# EAGLE design recepteur_led (EAGLE 6.5.0)
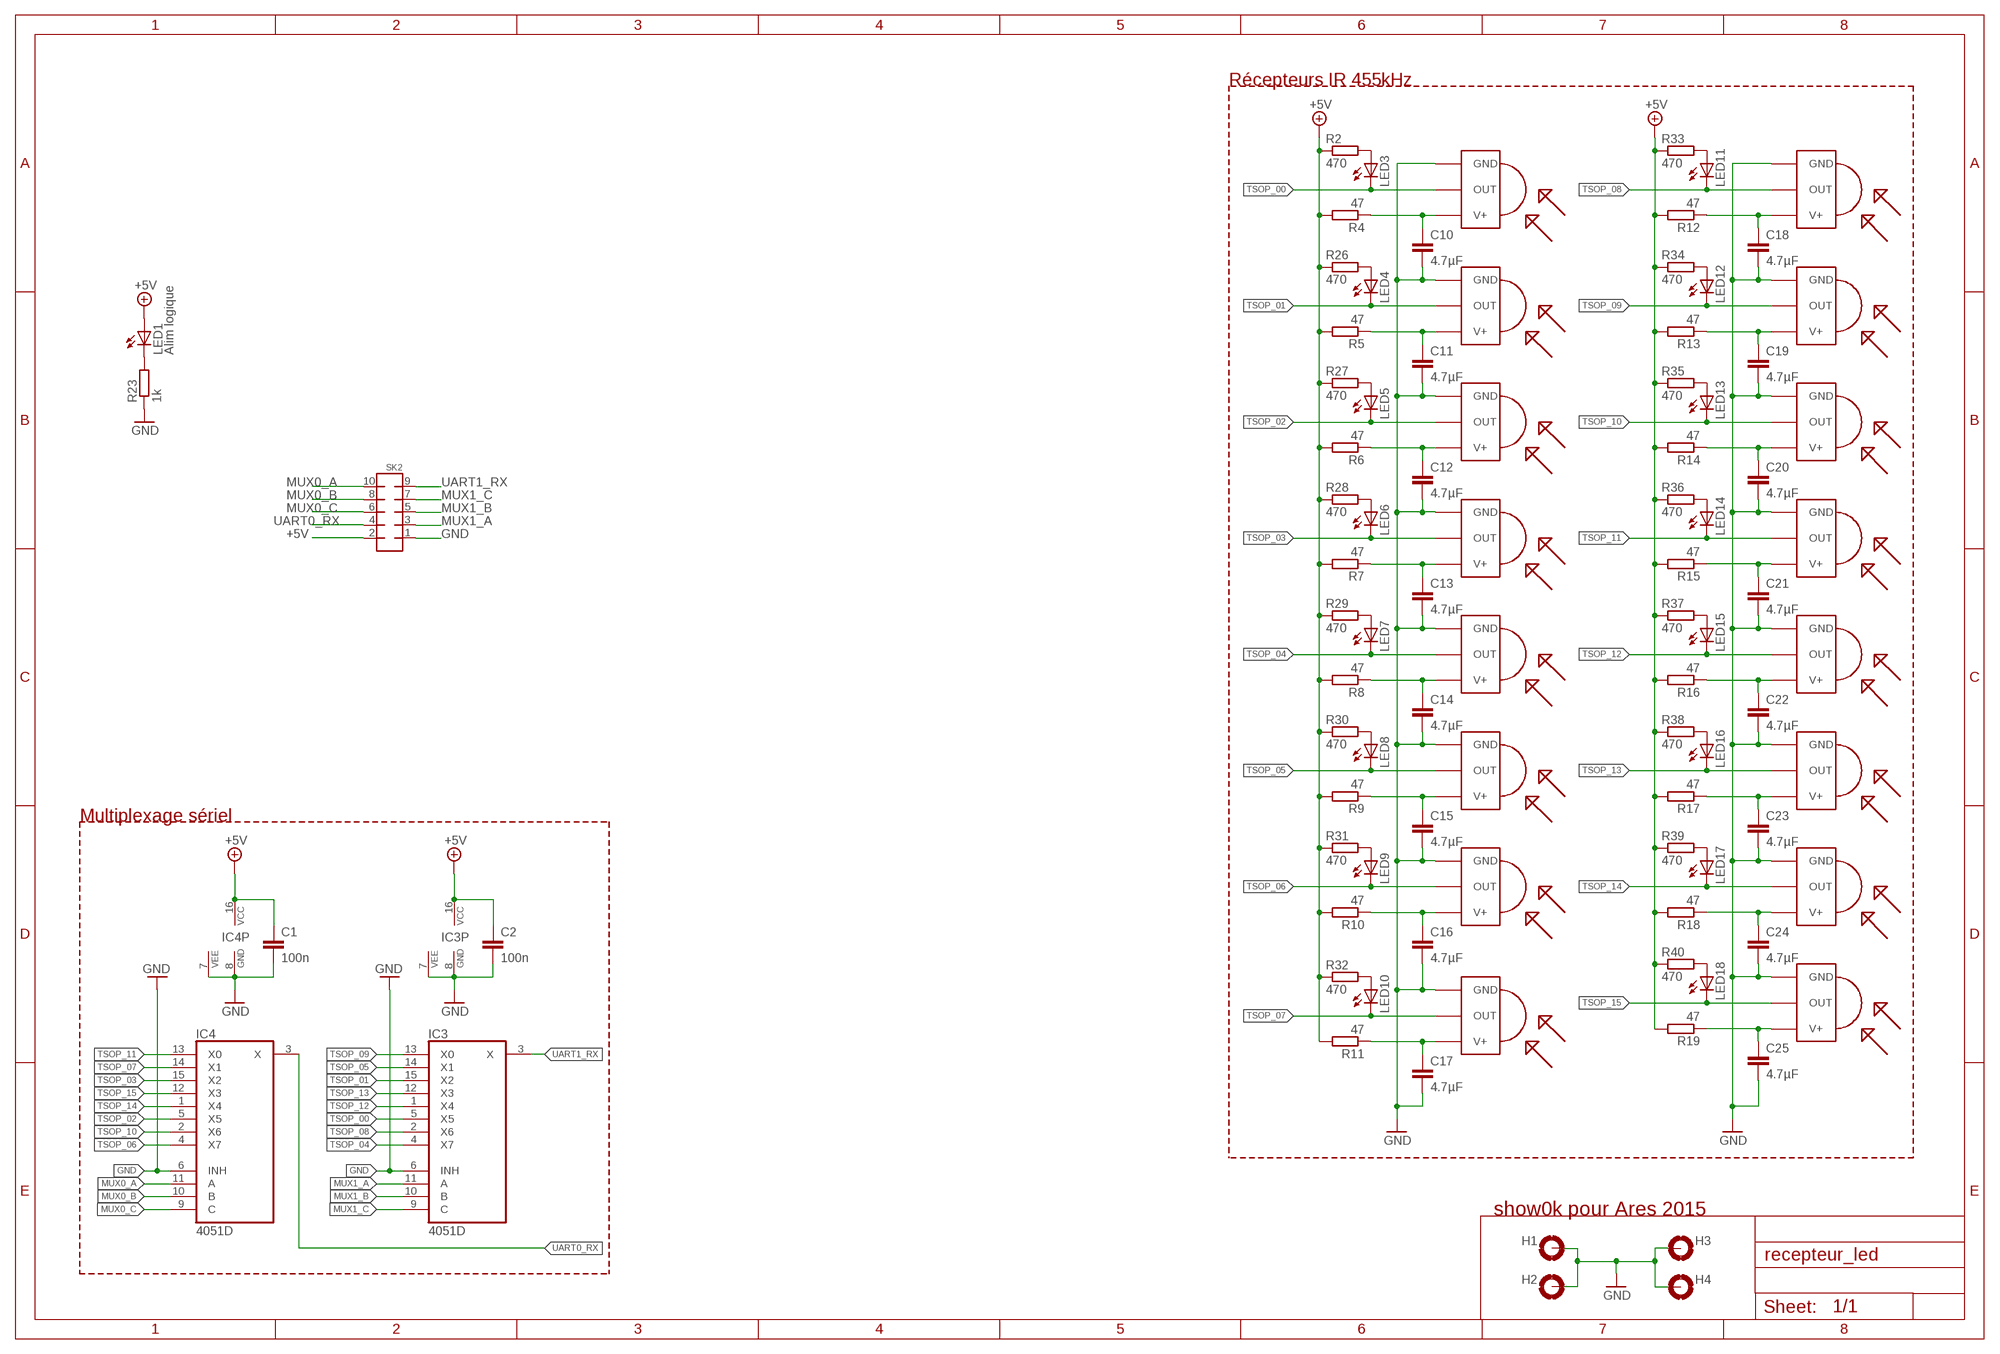
[diagram p0: schematic, sheet 1]

## Parts
C1  100n  C-EUC0805  [C0805]
C2  100n  C-EUC0805  [C0805]
C10  4.7µF  C-EUC0805  [C0805]
C11  4.7µF  C-EUC0805  [C0805]
C12  4.7µF  C-EUC0805  [C0805]
C13  4.7µF  C-EUC0805  [C0805]
C14  4.7µF  C-EUC0805  [C0805]
C15  4.7µF  C-EUC0805  [C0805]
C16  4.7µF  C-EUC0805  [C0805]
C17  4.7µF  C-EUC0805  [C0805]
C18  4.7µF  C-EUC0805  [C0805]
C19  4.7µF  C-EUC0805  [C0805]
C20  4.7µF  C-EUC0805  [C0805]
C21  4.7µF  C-EUC0805  [C0805]
C22  4.7µF  C-EUC0805  [C0805]
C23  4.7µF  C-EUC0805  [C0805]
C24  4.7µF  C-EUC0805  [C0805]
C25  4.7µF  C-EUC0805  [C0805]
H1  MOUNT-PAD-ROUND3.0  [3,0-PAD]
H2  MOUNT-PAD-ROUND3.0  [3,0-PAD]
H3  MOUNT-PAD-ROUND3.0  [3,0-PAD]
H4  MOUNT-PAD-ROUND3.0  [3,0-PAD]
IC3  4051D  [SO16]
IC4  4051D  [SO16]
LED1  Alim logique  LEDCHIP-LED0805  [CHIP-LED0805]
LED3  LEDCHIP-LED0805  [CHIP-LED0805]
LED4  LEDCHIP-LED0805  [CHIP-LED0805]
LED5  LEDCHIP-LED0805  [CHIP-LED0805]
LED6  LEDCHIP-LED0805  [CHIP-LED0805]
LED7  LEDCHIP-LED0805  [CHIP-LED0805]
LED8  LEDCHIP-LED0805  [CHIP-LED0805]
LED9  LEDCHIP-LED0805  [CHIP-LED0805]
LED10  LEDCHIP-LED0805  [CHIP-LED0805]
LED11  LEDCHIP-LED0805  [CHIP-LED0805]
LED12  LEDCHIP-LED0805  [CHIP-LED0805]
LED13  LEDCHIP-LED0805  [CHIP-LED0805]
LED14  LEDCHIP-LED0805  [CHIP-LED0805]
LED15  LEDCHIP-LED0805  [CHIP-LED0805]
LED16  LEDCHIP-LED0805  [CHIP-LED0805]
LED17  LEDCHIP-LED0805  [CHIP-LED0805]
LED18  LEDCHIP-LED0805  [CHIP-LED0805]
R2  470  R-EU_R0805  [R0805]
R4  47  R-EU_R0805  [R0805]
R5  47  R-EU_R0805  [R0805]
R6  47  R-EU_R0805  [R0805]
R7  47  R-EU_R0805  [R0805]
R8  47  R-EU_R0805  [R0805]
R9  47  R-EU_R0805  [R0805]
R10  47  R-EU_R0805  [R0805]
R11  47  R-EU_R0805  [R0805]
R12  47  R-EU_R0805  [R0805]
R13  47  R-EU_R0805  [R0805]
R14  47  R-EU_R0805  [R0805]
R15  47  R-EU_R0805  [R0805]
R16  47  R-EU_R0805  [R0805]
R17  47  R-EU_R0805  [R0805]
R18  47  R-EU_R0805  [R0805]
R19  47  R-EU_R0805  [R0805]
R23  1k  R-EU_M0805  [M0805]
R26  470  R-EU_R0805  [R0805]
R27  470  R-EU_R0805  [R0805]
R28  470  R-EU_R0805  [R0805]
R29  470  R-EU_R0805  [R0805]
R30  470  R-EU_R0805  [R0805]
R31  470  R-EU_R0805  [R0805]
R32  470  R-EU_R0805  [R0805]
R33  470  R-EU_R0805  [R0805]
R34  470  R-EU_R0805  [R0805]
R35  470  R-EU_R0805  [R0805]
R36  470  R-EU_R0805  [R0805]
R37  470  R-EU_R0805  [R0805]
R38  470  R-EU_R0805  [R0805]
R39  470  R-EU_R0805  [R0805]
R40  470  R-EU_R0805  [R0805]
SK2  MMATCH-10-PTH  [AMP-215079-10]
TSOP00  TSOP7000  TSOP1830  [TSOP18XX]
TSOP01  TSOP7000  TSOP1830  [TSOP18XX]
TSOP02  TSOP7000  TSOP1830  [TSOP18XX]
TSOP03  TSOP7000  TSOP1830  [TSOP18XX]
TSOP04  TSOP7000  TSOP1830  [TSOP18XX]
TSOP05  TSOP7000  TSOP1830  [TSOP18XX]
TSOP06  TSOP7000  TSOP1830  [TSOP18XX]
TSOP07  TSOP7000  TSOP1830  [TSOP18XX]
TSOP08  TSOP7000  TSOP1830  [TSOP18XX]
TSOP09  TSOP7000  TSOP1830  [TSOP18XX]
TSOP10  TSOP7000  TSOP1830  [TSOP18XX]
TSOP11  TSOP7000  TSOP1830  [TSOP18XX]
TSOP12  TSOP7000  TSOP1830  [TSOP18XX]
TSOP13  TSOP7000  TSOP1830  [TSOP18XX]
TSOP14  TSOP7000  TSOP1830  [TSOP18XX]
TSOP15  TSOP7000  TSOP1830  [TSOP18XX]

## Nets
+5V: C1.1 C2.1 IC3.16(VCC) IC4.16(VCC) LED1.A R2.1 R4.2 R5.2 R6.2 R7.2 R8.2 R9.2 R10.2 R11.2 R12.2 R13.2 R14.2 R15.2 R16.2 R17.2 R18.2 R19.2 R26.1 R27.1 R28.1 R29.1 R30.1 R31.1 R32.1 R33.1 R34.1 R35.1 R36.1 R37.1 R38.1 R39.1 R40.1 SK2.2
GND: C1.2 C2.2 C10.2 C11.2 C12.2 C13.2 C14.2 C15.2 C16.2 C17.2 C18.2 C19.2 C20.2 C21.2 C22.2 C23.2 C24.2 C25.2 H1.B3,0(MOUNT) H2.B3,0(MOUNT) H3.B3,0(MOUNT) H4.B3,0(MOUNT) IC3.6(INH) IC3.7(VEE) IC3.8(GND) IC4.6(INH) IC4.7(VEE) IC4.8(GND) R23.1 SK2.1 TSOP00.GND TSOP01.GND TSOP02.GND TSOP03.GND TSOP04.GND TSOP05.GND TSOP06.GND TSOP07.GND TSOP08.GND TSOP09.GND TSOP10.GND TSOP11.GND TSOP12.GND TSOP13.GND TSOP14.GND TSOP15.GND
MUX0_A: IC4.11(A) SK2.10
MUX0_B: IC4.10(B) SK2.8
MUX0_C: IC4.9(C) SK2.6
MUX1_A: IC3.11(A) SK2.3
MUX1_B: IC3.10(B) SK2.5
MUX1_C: IC3.9(C) SK2.7
N$2: LED3.A R2.2
N$3: LED4.A R26.2
N$4: LED5.A R27.2
N$6: LED6.A R28.2
N$7: LED7.A R29.2
N$9: C10.1 R4.1 TSOP00.VCC(V+)
N$10: C11.1 R5.1 TSOP01.VCC(V+)
N$11: C12.1 R6.1 TSOP02.VCC(V+)
N$12: C13.1 R7.1 TSOP03.VCC(V+)
N$15: LED1.C R23.2
N$16: LED8.A R30.2
N$18: LED9.A R31.2
N$19: LED10.A R32.2
N$20: LED11.A R33.2
N$21: C14.1 R8.1 TSOP04.VCC(V+)
N$22: C15.1 R9.1 TSOP05.VCC(V+)
N$23: C16.1 R10.1 TSOP06.VCC(V+)
N$24: LED12.A R34.2
N$26: LED13.A R35.2
N$27: LED14.A R36.2
N$28: LED15.A R37.2
N$29: LED16.A R38.2
N$30: LED17.A R39.2
N$31: LED18.A R40.2
N$32: C17.1 R11.1 TSOP07.VCC(V+)
N$33: C25.1 R19.1 TSOP15.VCC(V+)
N$35: C24.1 R18.1 TSOP14.VCC(V+)
N$36: C23.1 R17.1 TSOP13.VCC(V+)
N$37: C22.1 R16.1 TSOP12.VCC(V+)
N$38: C21.1 R15.1 TSOP11.VCC(V+)
N$39: C19.1 R13.1 TSOP09.VCC(V+)
N$40: C20.1 R14.1 TSOP10.VCC(V+)
N$41: C18.1 R12.1 TSOP08.VCC(V+)
TSOP_00: IC3.5(X5) LED3.C TSOP00.OUT
TSOP_01: IC3.15(X2) LED4.C TSOP01.OUT
TSOP_02: IC4.5(X5) LED5.C TSOP02.OUT
TSOP_03: IC4.15(X2) LED6.C TSOP03.OUT
TSOP_04: IC3.4(X7) LED7.C TSOP04.OUT
TSOP_05: IC3.14(X1) LED8.C TSOP05.OUT
TSOP_06: IC4.4(X7) LED9.C TSOP06.OUT
TSOP_07: IC4.14(X1) LED10.C TSOP07.OUT
TSOP_08: IC3.2(X6) LED11.C TSOP08.OUT
TSOP_09: IC3.13(X0) LED12.C TSOP09.OUT
TSOP_10: IC4.2(X6) LED13.C TSOP10.OUT
TSOP_11: IC4.13(X0) LED14.C TSOP11.OUT
TSOP_12: IC3.1(X4) LED15.C TSOP12.OUT
TSOP_13: IC3.12(X3) LED16.C TSOP13.OUT
TSOP_14: IC4.1(X4) LED17.C TSOP14.OUT
TSOP_15: IC4.12(X3) LED18.C TSOP15.OUT
UART0_RX: IC4.3(X) SK2.4
UART1_RX: IC3.3(X) SK2.9

## Notes on the sheet
- Récepteurs IR 455kHz
- Multiplexage sériel
- show0k pour Ares 2015

## Library data of the parts
C1 C2 C10-C25 = rcl:C-EU: CAPACITOR, European symbol
H1-H4 = holes:MOUNT-PAD-ROUND: MOUNTING PAD, round
IC3 IC4 = 40xx:4051: 8-channel ANALOG MULTIPLEXER
LED1 LED3-LED18 = led:LED: LED OSRAM: - CHIPLED LG R971, LG N971, LY N971, LG Q971, LY Q971, LO R971, LY R971 LH N974, LH R974 LS Q976, LO Q976, LY Q976 LO Q996 - Hyper CHIPLED LW Q18S LB Q993, LB Q99A, LB R99A - SideLED LS A670, LO A670, LY A670, LG A670, LP A670 LB A673, LV A673, LT A673, LW A673 LH A674 LY A675 LS A676, LA A676, LO A676, LY A676, LW A676 LS A679, LY A679, LG A679 - Hyper Micro SIDELED® LS Y876, LA Y876, LO Y876, LY Y876 LT Y87S - SmartLED LW L88C, LW L88S LB L89C, LB L89S, LG L890 LS L89K, LO L89K, LY L89K LS L896, LA L896, LO L896, LY L896 - TOPLED LS T670, LO T670, LY T670, LG T670, LP T670 LSG T670, LSP T670, LSY T670, LOP T670, LYG T670 LG T671, LOG T671, LSG T671 LB T673, LV T673, LT T673, LW T673 LH T674 LS T676, LA T676, LO T676, LY T676, LB T676, LH T676, LSB T676, LW T676 LB T67C, LV T67C, LT T67C, LS T67K, LO T67K, LY T67K, LW E67C LS E67B, LA E67B, LO E67B, LY E67B, LB E67C, LV E67C, LT E67C LW T67C LS T679, LY T679, LG T679 LS T770, LO T770, LY T770, LG T770, LP T770 LB T773, LV T773, LT T773, LW T773 LH T774 LS E675, LA E675, LY E675, LS T675 LS T776, LA T776, LO T776, LY T776, LB T776 LHGB T686 LT T68C, LB T68C - Hyper Mini TOPLED® LB M676 - Mini TOPLED Santana® LG M470 LS M47K, LO M47K, LY M47K Source: http://www.osram.convergy.de - LUMILED® LXK2-PW12-R00, LXK2-PW12-S00, LXK2-PW14-U00, LXK2-PW14-V00 LXK2-PM12-R00, LXK2-PM12-S00, LXK2-PM14-U00 LXK2-PE12-Q00, LXK2-PE12-R00, LXK2-PE12-S00, LXK2-PE14-T00, LXK2-PE14-U00 LXK2-PB12-K00, LXK2-PB12-L00, LXK2-PB12-M00, LXK2-PB14-N00, LXK2-PB14-P00, LXK2-PB14-Q00 LXK2-PR12-L00, LXK2-PR12-M00, LXK2-PR14-Q00, LXK2-PR14-R00 LXK2-PD12-Q00, LXK2-PD12-R00, LXK2-PD12-S00 LXK2-PH12-R00, LXK2-PH12-S00 LXK2-PL12-P00, LXK2-PL12-Q00, LXK2-PL12-R00 Source: www.luxeon.com
R2 R4-R19 R23 R26-R40 = rcl:R-EU_: RESISTOR, European symbol
SK2 = jt-con-micromatch:MMATCH-10-*: AMP Micromatch 10-pin
TSOP00 TSOP01-TSOP09 TSOP10-TSOP15 = tsop:TSOP1830: IR Receiver and Demodulator

## Board
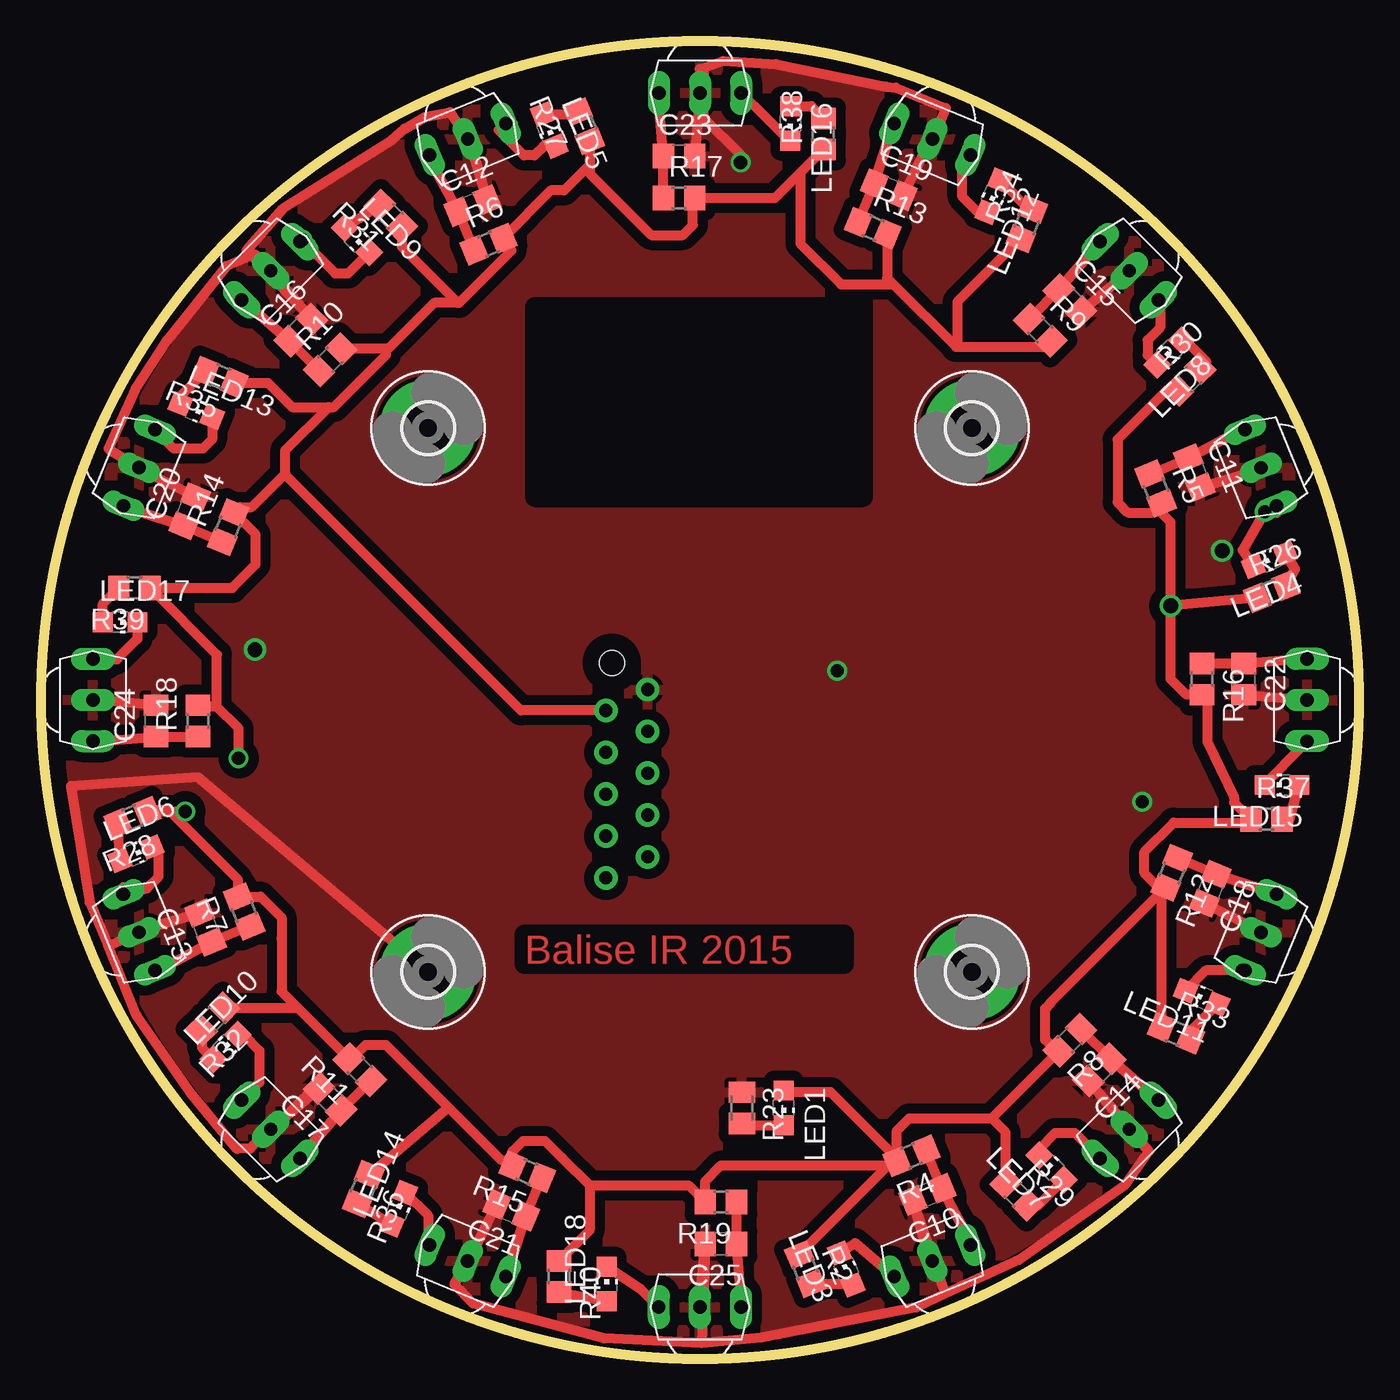
[diagram p1: board, top side]
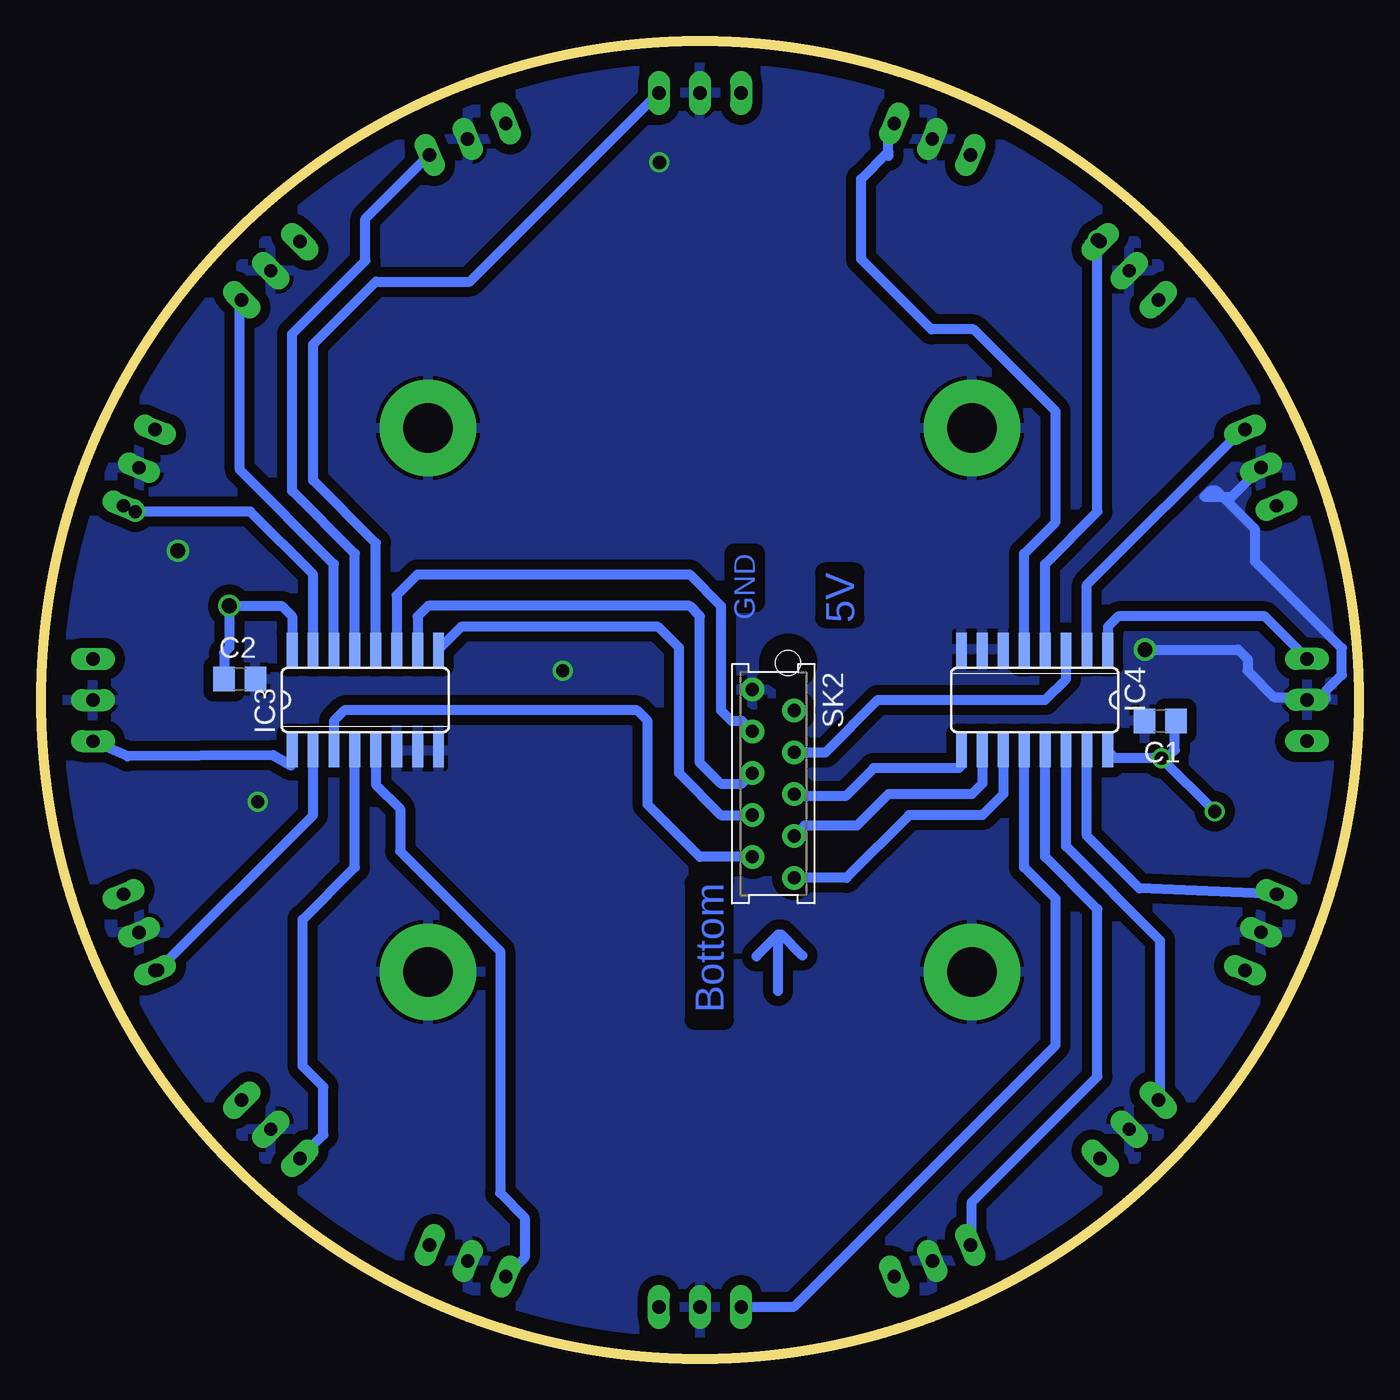
[diagram p2: board, bottom side, seen from below]

Size 80 x 80 mm. Coordinates in mm from the lower left corner, seen from the top.
Outline: circle at 40,40 radius 40
Copper layers (1*16): Top 0.1mm / dielectric 1.5mm / Bottom 0.1mm
Design rules "ensea *": minimum track width 0.5mm, minimum drill 0.5mm, track to track 0.4mm, track to pad 0.4mm, pad to pad 0.5mm, via to via 0.5mm, smd to smd 8mil, copper to edge 40mil, drill to drill 8mil, minimum pad ring 10mil, minimum via ring 8mil, stop-mask expansion 4mil, vias tented up to drill 0mil, thermal gap 10mil
tRestrict: area 30,52.3 to 49.9,63.9

### Footprints (pad centres in the part's own frame; a part is rotated, then mirrored left to right if it is on the bottom)
C0805 = smd 1.3 x 1.5: 1 -0.95,0; 2 0.95,0
3,0-PAD = drill 3 pad 5.842: B3,0 0,0
SO16 = smd 0.66 x 2.032: 1 -4.445,-3.073; 2 -3.175,-3.073; 3 -1.905,-3.073; 4 -0.635,-3.073; 5 0.635,-3.073; 6 1.905,-3.073; 7 3.175,-3.073; 8 4.445,-3.073; 9 4.445,3.073; 10 3.175,3.073; 11 1.905,3.073; 12 0.635,3.073; 13 -0.635,3.073; 14 -1.905,3.073; 15 -3.175,3.073; 16 -4.445,3.073
CHIP-LED0805 = smd 1.2 x 1.2: A 0,-1.05; C 0,1.05
R0805 = smd 1.3 x 1.5: 1 -0.95,0; 2 0.95,0
M0805 = smd 1.3 x 1.6: 1 -0.95,0; 2 0.95,0
AMP-215079-10 = drill 0.8 pad 1.422: 1 0,-1.27; 2 1.27,1.27; 3 2.54,-1.27; 4 3.81,1.27; 5 5.08,-1.27; 6 6.35,1.27; 7 7.62,-1.27; 8 8.89,1.27; 9 10.16,-1.27; 10 11.43,1.27 | hole 1.5: -1.62,0.905
TSOP18XX = drill 0.813 long: GND -0.001,-0.027; OUT -2.501,-0.027; VCC 2.499,-0.027

### Placement (x,y rotation side)
C1  12.06,38.73 180 bottom
C2  67.94,41.27 0 bottom
C10  53.81,9.98 202.5 top
C11  70.02,53.81 292.5 top
C12  26.19,70.02 22.5 top
C13  9.98,26.19 112.5 top
C14  64.25,17.55 225 top
C15  62.45,64.25 315 top
C16  15.75,62.45 45 top
C17  17.55,15.75 135 top
C18  70.99,28.54 247.5 top
C19  51.46,70.99 337.5 top
C20  9.01,51.46 67.5 top
C21  28.54,9.01 157.5 top
C22  73.02,41.27 270 top
C23  38.73,73.02 0 top
C24  6.98,38.73 90 top
C25  41.27,6.98 180 top
H1  56.51,23.49 0 top
H2  23.49,23.49 0 top
H3  56.51,56.51 0 top
H4  23.49,56.51 0 top
IC3  60.32,40 0 bottom
IC4  19.68,40 180 bottom
LED1  45.08,15.23 180 top
LED3  48.87,5.45 22.5 top
LED4  74.57,48.51 112.5 top
LED5  30.85,74.6 202.5 top
LED6  5.76,30.68 292.5 top
LED7  61.33,11.61 45 top
LED8  68.49,61.1 135 top
LED9  19.17,67.93 225 top
LED10  11.2,18.92 315 top
LED11  70.46,21.95 67.5 top
LED12  57.82,70.58 157.5 top
LED13  9.42,57.57 247.5 top
LED14  21.69,9.11 337.5 top
LED15  75.33,34.84 90 top
LED16  45.49,75 180 top
LED17  4.8,44.72 270 top
LED18  34.34,4.54 0 top
R2  46.39,5.44 292.5 top
R4  52.84,12.33 202.5 top
R5  67.67,52.84 292.5 top
R6  27.16,67.67 22.5 top
R7  12.33,27.16 112.5 top
R8  62.45,19.35 225 top
R9  60.65,62.45 315 top
R10  17.55,60.65 45 top
R11  19.35,17.55 135 top
R12  68.65,29.51 247.5 top
R13  50.49,68.65 337.5 top
R14  11.35,50.49 67.5 top
R15  29.51,11.35 157.5 top
R16  70.48,41.27 270 top
R17  38.73,70.48 0 top
R18  9.52,38.73 90 top
R19  41.27,9.52 180 top
R23  42.54,15.23 270 top
R26  74.71,46.57 22.5 top
R27  32.95,74.83 112.5 top
R28  5.55,32.87 202.5 top
R29  59.23,9.99 315 top
R30  69.7,59.46 45 top
R31  21.22,69.37 135 top
R32  10.42,20.64 225 top
R33  68.9,19.78 337.5 top
R34  59.84,68.9 67.5 top
R35  10.85,59.61 157.5 top
R36  19.55,10.31 247.5 top
R37  74.39,32.76 0 top
R38  47.49,74.37 90 top
R39  5.66,46.81 180 top
R40  31.44,5 270 top
SK2  35.55,40.63 270 bottom
TSOP00  54.09,5.97 22.5 top
TSOP01  74.03,54.09 112.5 top
TSOP02  25.91,74.03 202.5 top
TSOP03  5.97,25.91 292.5 top
TSOP04  66.04,13.96 45 top
TSOP05  66.04,66.04 135 top
TSOP06  13.96,66.04 225 top
TSOP07  13.96,13.96 315 top
TSOP08  74.03,25.91 67.5 top
TSOP09  54.09,74.03 157.5 top
TSOP10  5.97,54.09 247.5 top
TSOP11  25.91,5.97 337.5 top
TSOP12  76.83,40 90 top
TSOP13  40,76.83 180 top
TSOP14  3.17,40 270 top
TSOP15  40,3.17 0 top

### Tracks (layer width: path | path; a pad name or v marks a point on that pad's centre or on a via)
+5V  (via drill 0.61 pad 1.27, 0.8, 0.9)
  Top 0.61: R11.2 18.86,18.22 19.68,19.04 20.95,19.04 24.76,15.23 | 24.76,15.23 27.93,12.06 28.29,12.06 R15.2 28.63,12.6 29.26,13.23 30.58,13.23 31.59,12.21 31.62,12.21 33.29,10.54 | R36.1 24.7,15.23 24.76,15.23 | R16.2 69.53,40.32 68.58,41.27 v68.58,45.71 | v68.58,45.71 68.58,50.8 68.04,51.33 R5.2 67.46,51.38 65.98,51.38 65.35,52.01 65.35,55.82 68.31,58.79 R30.1 | 17.45,57.78 15.23,57.78 14.54,58.48 13.77,59.25 R35.1 | 17.45,57.78 17.77,57.78 20.95,60.95 20.95,61.21 | 20.95,61.21 20.95,61.33 R10.2 | 25.29,64.11 25.38,64.11 28.57,67.3 28.04,67.83 R6.2 30.94,70.94 31.74,70.94 33.31,72.5 | R11.2 14.6,22.29 14.6,25.52 14.6,26.79 13.33,28.06 12.06,28.06 R7.2 11.96,29.07 7.74,33.29 6.49,33.29 R28.1 v8.75,33.23 | 51.43,11.74 41.27,11.74 40.32,10.79 R19.2 39.3,10.54 33.29,10.54 | 51.43,11.74 51.74,11.74 R4.2 | R4.2 51.96,12.16 47.94,16.19 45.18,16.19 LED1.A | R4.2 51.96,13.86 52.7,14.6 57.7,14.6 | 57.7,14.6 R8.2 61.64,18.67 60.95,19.36 60.95,21.27 61.27,21.59 61.27,21.62 R12.2 | 51.43,11.74 46.69,7 R2.1 | 70.48,40 R16.2 | R16.2 70.8,40.63 70.8,37.46 72.44,34.07 72.44,33.77 R37.1 73.24,32.56 68.75,32.56 66.97,30.78 66.97,29.48 67.83,28.63 R12.2 | R29.1 58.56,13.74 57.7,14.6 | R33.1 68.02,28.37 R12.2 | R32.1 15.58,21.31 R11.2 | 14.78,53.72 12.77,51.71 12.06,51.71 R14.2 13.02,50.06 13.02,48.23 11.6,46.81 R39.1 10.66,42.75 10.66,39.59 | 14.78,53.72 14.83,53.77 14.83,55.16 17.45,57.78 | R27.1 33.31,72.5 | 33.31,72.5 33.31,71.96 37.05,68.22 38.96,68.22 39.57,68.83 39.57,70.37 R17.2 39.75,70.48 44.56,70.48 R38.1 46.1,72.02 46.1,67.71 48.57,65.23 51.75,65.23 | R13.2 51.37,65.61 51.75,65.23
  Top 0.61: 51.75,65.23 55.55,61.44 55.62,61.44 | 55.62,61.44 60.98,61.44 R9.2 | R31.1 21.9,67.51 25.29,64.11 | 25.29,64.11 23.85,64.11 20.95,61.21 | v11.98,36.47 11.98,38.27 10.66,39.59 | 10.66,39.59 9.61,39.59 R18.2 | SK2.2 29.13,39.37 14.78,53.72 | R34.1 55.62,64.17 55.62,61.44 | R26.1 v68.58,45.71 | R16.2 | R16.2 | 33.29,10.54 33.29,7.8 R40.1
  Bottom 0.61: 11.11,39.05 10.79,38.73 C1.1 11.17,38.67 11.17,36.98 11.68,36.47 v11.98,36.47 | IC3.16 64.77,45.08 65.4,45.71 v68.58,45.71 68.58,43.17 68.89,42.86 C2.1 69.21,41.27 68.89,40.95 | v11.98,36.47 14.78,36.47 IC4.16 | v8.75,33.23 v11.98,36.47
GND  (via drill 0.8, 0.9)
  Top 0.61: C19.2 53.97,73.97 TSOP09.GND 54.94,75.94 51.89,77.19 51.3,77.24 44.62,78.61 41.4,78.81 39.98,78.3 40.23,78.05 40.23,75.33 42.46,73.1 v42.46,72.64 | TSOP01.GND 73.97,53.97 C11.2 | TSOP08.GND 73.97,26.03 C18.2 | TSOP00.GND 53.97,6.03 C10.2 54.88,3.96 | C21.2 26.03,6.03 TSOP11.GND 25.09,4.52 26.21,3.37 34.16,1.24 40.1,0.96 | C13.2 6.03,26.03 TSOP03.GND 4.06,25.09 | C20.2 6.03,53.97 TSOP10.GND 4.08,55.27 5.73,58.92 7.62,61.82 11.22,66.34 12.97,67.05 C16.2 | C12.2 26.03,73.97 TSOP02.GND 24.84,75.69 23.31,75.41 22.07,74.7 21.28,73.98 14.7,69.84 12.47,67.3 C16.2 | TSOP13.GND 40,76.83 C23.2 | TSOP05.GND 66.03,66.03 C15.2 | TSOP12.GND 76.83,40 C22.2 | TSOP04.GND 66.03,13.96 C14.2 67.25,12.59 65.78,10.54 59.38,6.01 54.88,3.96 | TSOP15.GND 40,3.49 C25.2 40.1,0.96 | TSOP07.GND 13.96,13.96 C17.2 16.55,16.43 13.84,13.71 13.63,13.71 12.7,12.77 11.88,12.75 9.01,16.23 5.79,20.87 4.06,25.09 | TSOP14.GND 3.17,40 C24.2 | TSOP06.GND 13.96,66.03 C16.2 | 54.88,3.96 53.16,3.12 43.73,1.29 40.1,0.96 | H2.B3,0 9.52,35.3 1.8,34.77 2.94,27.71 4.06,25.09
  Bottom 0.61: v12.99,43.06 7.32,43.06 6.75,42.49 6.75,41.78 5.15,40.18 2.1,40.18 2,40.08 2,40.56 1.04,41.52 1.04,43.15 6.29,48.41 6.29,50.36 8.64,52.7 9.01,52.7 C20.2 7.71,52.34 TSOP10.GND
  other vias: 71.7,49.06 48.33,41.78 66.85,33.83
  pour Bottom (isolate 0.61): 80.64,-0.64 -13.91,-6.23 -7.63,81.28 80.64,80.64
  pour Top (isolate 0.61): 80.64,-0.64 -11.39,-5.62 -6.36,78.73 80.64,80.64
MUX0_A
  Bottom 0.61: IC4.11 21.59,34.28 22.86,33.02 27.3,33.02 31.11,29.2 SK2.10
MUX0_B
  Bottom 0.61: IC4.10 22.86,34.92 23.49,34.28 28.57,34.28 30.47,32.38 33.65,32.38 SK2.8
MUX0_C
  Bottom 0.61: IC4.9 24.12,36.01 24.28,35.86 29.46,35.86 31.16,34.16 34.16,34.16 SK2.6
MUX1_A
  Bottom 0.61: IC3.11 58.41,46.35 57.14,47.62 40.63,47.62 38.73,45.71 38.73,39.37 38.09,38.73 37.46,38.73 SK2.3
MUX1_B
  Bottom 0.61: IC3.10 57.14,45.08 56.51,45.71 40.63,45.71 40,45.08 40,36.19 38.73,34.92 37.46,34.92 SK2.5
MUX1_C
  Bottom 0.61: IC3.9 54.5,44.45 42.54,44.45 41.27,43.17 41.27,35.55 38.73,33.02 SK2.7
N$1
  Bottom 0.61: 35.23,25.32 35.28,25.32 35.28,22.35
N$2
  Top 0.61: R2.2 49.18,4.57 LED3.A
N$3
  Top 0.61: LED4.A 76.12,47.92 R26.2
N$4
  Top 0.61: LED5.A 32.44,75.57 R27.2
N$5
  Bottom 0.61: 33.78,24.48 35.05,25.75 35.28,25.75
N$6
  Top 0.61: R28.2 4.78,30.09 4.79,30.1 LED6.A
N$7
  Top 0.61: R29.2 60.53,9.32 LED7.A
N$8
  Bottom 0.61: 35.43,25.6 36.57,24.45 36.57,24.43
N$9
  Top 0.61: R4.1 54.6,10.47 C10.1 56.51,6.98 TSOP00.VCC
N$10
  Top 0.61: TSOP01.VCC 73.02,56.51 C11.1 69.53,54.6 R5.1
N$11
  Top 0.61: R6.1 25.39,69.53 C12.1 23.49,73.02 TSOP02.VCC
N$12
  Top 0.61: R7.1 10.47,25.39 C13.1 6.98,23.49 TSOP03.VCC
N$15
  Top 0.61: R23.2 42.54,13.96 42.76,14.18 LED1.C
N$16
  Top 0.61: LED8.A 69.46,61.85 70.73,60.57 70.73,60.49 R30.2
N$18
  Top 0.61: LED9.A R31.2
N$19
  Top 0.61: R32.2 9.75,18.89 LED10.A
N$20
  Top 0.61: R33.2 69.78,19.9 LED11.A
N$21
  Top 0.61: TSOP04.VCC 67.62,15.87 C14.1 65.05,18.09 | 65.05,18.09 65.08,18.09 | 65.05,18.09 R8.1 | 65.05,18.09
N$22
  Top 0.61: TSOP05.VCC 64.13,67.62 C15.1 61.91,65.05 | R9.1 61.91,65.05 | 61.91,65.05 61.91,65.08
N$23
  Top 0.61: TSOP06.VCC 12.38,64.13 C16.1 15.21,61.91 15.23,61.91 15.23,61.62 R10.1
N$24
  Top 0.61: LED12.A 60,69.78 R34.2
N$26
  Top 0.61: LED13.A 8.45,58.45 R35.2
N$27
  Top 0.61: R36.2 LED14.A
N$28
  Top 0.61: R37.2 75.7,32.38 75.8,32.83 LED15.A
N$29
  Top 0.61: LED16.A 46.76,76.05 R38.2
N$30
  Top 0.61: LED17.A 3.74,45.84 R39.2
N$31
  Top 0.61: R40.2 LED18.A
N$32
  Top 0.61: TSOP07.VCC 15.87,12.38 C17.1 18.37,15.23 18.41,15.23 18.41,15.27 R11.1
N$33
  Top 0.61: TSOP15.VCC 42.54,3.17 C25.1 42.22,7.29 42.22,7.3 R19.1
N$35
  Top 0.61: TSOP14.VCC 3.17,37.46 C24.1 R18.1
N$36
  Top 0.61: TSOP13.VCC 37.46,76.83 C23.1 37.78,72.7 R17.1
N$37
  Top 0.61: TSOP12.VCC 76.83,42.54 C22.1 72.7,42.22 R16.1
N$38
  Top 0.61: R15.1 29.52,8.88 C21.1 28.25,5.07 TSOP11.VCC
N$39
  Top 0.61: R13.1 50.48,71.11 C19.1 51.75,74.92 TSOP09.VCC
N$40
  Top 0.61: R14.1 8.88,50.48 C20.1 5.07,51.75 TSOP10.VCC
N$41
  Top 0.61: R12.1 71.11,29.52 C18.1 74.92,28.25 TSOP08.VCC
TSOP_00
  Top 0.61: TSOP00.OUT 49.42,7.03 LED3.C
  Bottom 0.61: IC3.5 59.69,34.87 58.21,33.4 58.21,30.83 52.14,24.76 52.14,10.08 50.64,8.58 50.64,6.14 TSOP00.OUT
TSOP_01  (via drill 0.8)
  Top 0.61: TSOP01.OUT 75.01,51.51 74.92,51.43 75,51.35 | v74.29,51.43 72.94,49.09 LED4.C
  Bottom 0.61: IC3.15 63.5,47.62 67.3,51.43 v74.29,51.43 74.65,51.79 TSOP01.OUT
TSOP_02
  Top 0.61: 28.64,75 28.57,74.92 28.49,75.01 TSOP02.OUT 27.82,74.62 27.76,74.62 29.31,73.07 29.94,73.07 30.5,73.63 LED5.C
  Bottom 0.61: IC4.5 20.31,48.89 18.41,50.8 18.41,57.53 23.39,62.5 25.95,62.5 30.22,66.77 30.22,71.62 28.57,73.27 | 28.57,73.02 28.57,73.27 | 28.57,73.27 28.57,74.29 28.21,74.65 TSOP02.OUT
TSOP_03  (via drill 0.8)
  Top 0.61: TSOP03.OUT 4.99,28.49 5.07,28.57 5,28.65 | v4.95,28.21 6.42,28.57 7.13,29.28 7.13,30.67 LED6.C
  Bottom 0.61: IC4.15 16.5,31.74 13.33,28.57 v4.95,28.21 4.58,27.85 TSOP03.OUT
TSOP_04
  Top 0.61: 64.18,12.06 TSOP04.OUT 62.75,13.71 61.56,13.71 60.59,12.74 LED7.C
  Bottom 0.61: IC3.4 60.95,29.84 64.13,26.66 64.13,17.77 62.86,16.5 62.86,13.6 TSOP04.OUT
TSOP_05
  Top 0.61: TSOP05.OUT 67.94,64.18 67.94,62.61 67.18,61.84 67.18,60.93 LED8.C
  Bottom 0.61: IC3.14 62.23,48.26 67.94,53.97 67.94,64.13 67.83,64.24 TSOP05.OUT
TSOP_06  (via drill 0.8)
  Top 0.61: v15.87,67.94 15.87,67.89 17.85,65.91 18.63,65.91 LED9.C
  Bottom 0.61: IC4.4 19.04,48.26 15.87,51.43 v15.87,67.94 15.76,67.83 TSOP06.OUT
TSOP_07
  Top 0.61: LED10.C 12.3,19.66 13.25,18.71 13.25,16.79 TSOP07.OUT
  Bottom 0.61: IC4.14 17.77,31.11 12.06,25.39 12.06,15.87 12.17,15.76 TSOP07.OUT
TSOP_08  (via drill 0.8)
  Top 0.61: 73.09,23.56 TSOP08.OUT | v72.92,23.59 70.72,23.59 LED11.C
  Bottom 0.61: IC3.2 63.5,33.02 v72.92,23.59 TSOP08.OUT
TSOP_09
  Top 0.61: 56.44,73.09 TSOP09.OUT 55.93,72.61 55.93,70.56 56.87,69.61 LED12.C
  Bottom 0.61: IC3.13 60.95,48.89 64.77,52.7 64.77,62.23 60.32,66.67 60.32,69.21 56.44,73.09 TSOP09.OUT
TSOP_10
  Top 0.61: 6.91,56.44 TSOP10.OUT 8.05,55.27 9.82,55.27 10.39,55.83 LED13.C
  Bottom 0.61: IC4.2 16.5,46.98 6.98,56.51 6.91,56.44 TSOP10.OUT
TSOP_11
  Top 0.61: 23.56,6.91 TSOP11.OUT 23.49,7 23.49,8.71 22.12,10.08 LED14.C
  Bottom 0.61: IC4.13 19.04,30.47 15.87,27.3 15.87,17.14 23.49,9.52 23.49,6.98 23.56,6.91 TSOP11.OUT
TSOP_12
  Top 0.61: TSOP12.OUT 76.86,37.49 75.78,36.41 LED15.C
  Bottom 0.61: IC3.1 64.84,36.01 65.93,36.65 74.75,36.57 76.86,37.49 TSOP12.OUT
TSOP_13  (1 unrouted)
  Top 0.61: 42.51,76.86 42.88,76.49 43.59,75.78 45.42,73.95 LED16.C
  Bottom 0.61: IC3.12 59.69,49.52 63.5,53.34 63.5,61.59 59.69,65.4 53.97,65.4 42.51,76.86 TSOP13.OUT
TSOP_14
  Top 0.61: LED17.C 5.84,43.72 4.59,42.46 3.18,42.46 TSOP14.OUT
  Bottom 0.61: IC4.1 15.23,44.45 14.6,45.08 5.71,45.08 3.14,42.51 TSOP14.OUT
TSOP_15
  Top 0.61: TSOP15.OUT 37.49,3.14 36.41,4.22 LED18.C
  Bottom 0.61: IC4.12 20.31,29.84 18.41,27.93 18.41,19.04 34.28,3.17 37.46,3.17 37.49,3.14 TSOP15.OUT
UART0_RX
  Bottom 0.61: SK2.4 32.38,36.83 29.2,40 19.04,40 17.77,41.27 IC4.3
UART1_RX
  Bottom 0.61: SK2.9 40,30.47 43.17,33.65 43.17,38.73 43.81,39.37 61.59,39.37 62.23,38.73 IC3.3

### Text on the board
Top: Balise IR 2015
Bottom: GND | 5V | Bottom